# EAGLE design RTC (EAGLE 7.2.0)
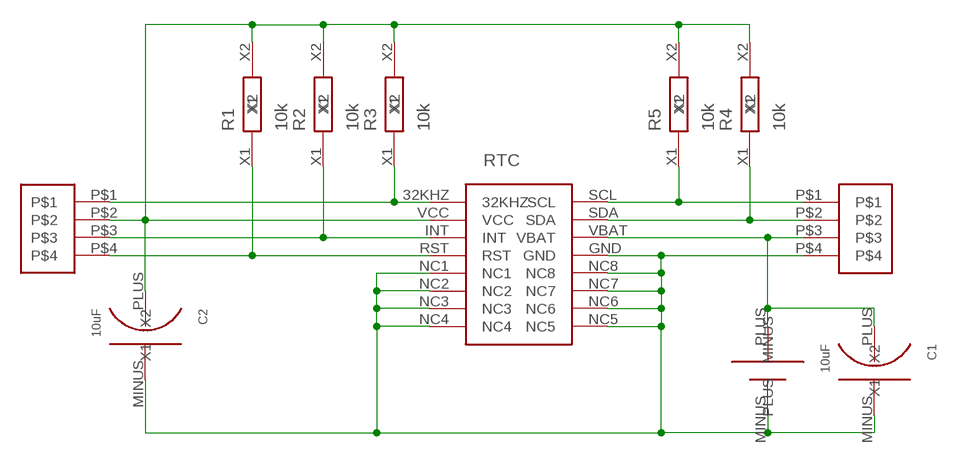
[diagram p0: schematic, sheet 1]

## Parts
C1  10uF  C_SMD_TA_A  [C_SMD_TA_A]
C2  10uF  C_SMD_TA_A  [C_SMD_TA_A]
R1  10k  R_SMD_2.1X1.25  [SMD_2.1X1.25]
R2  10k  R_SMD_2.1X1.25  [SMD_2.1X1.25]
R3  10k  R_SMD_2.1X1.25  [SMD_2.1X1.25]
R4  10k  R_SMD_2.1X1.25  [SMD_2.1X1.25]
R5  10k  R_SMD_2.1X1.25  [SMD_2.1X1.25]
RTC  RTC_DS3231  [RTC_DS3231]
U$2  VBAT  [VBAT]
U$3  4-PIN-NONAME  [4-PIN-NONAME]
U$4  4-PIN-NONAME  [4-PIN-NONAME]

## Nets
N$1: R3.X1 RTC.32KHZ U$4.P$1
N$2: C2.PLUS(X1) R1.X2 R2.X2 R3.X2 R4.X2 R5.X2 RTC.VCC U$4.P$2
N$3: R2.X1 RTC.INT U$4.P$3
N$4: R1.X1 RTC.RST U$4.P$4
N$5: R5.X1 RTC.SCL U$3.P$1
N$6: R4.X1 RTC.SDA U$3.P$2
N$7: C1.PLUS(X1) RTC.VBAT U$2.PLUS U$3.P$3
N$12: C1.MINUS(X2) C2.MINUS(X2) RTC.GND RTC.NC1 RTC.NC2 RTC.NC3 RTC.NC4 RTC.NC5 RTC.NC6 RTC.NC7 RTC.NC8 U$2.MINUS U$3.P$4

## Library data of the parts
C1 C2 = MyAmSys:C_SMD_TA_A
R1-R5 = MyPowerComponents:R_SMD_2.1X1.25
RTC = My_STM32:RTC_DS3231
U$2 = My_STM32:VBAT
U$3 U$4 = MyAmSys:4-PIN-NONAME

## Board
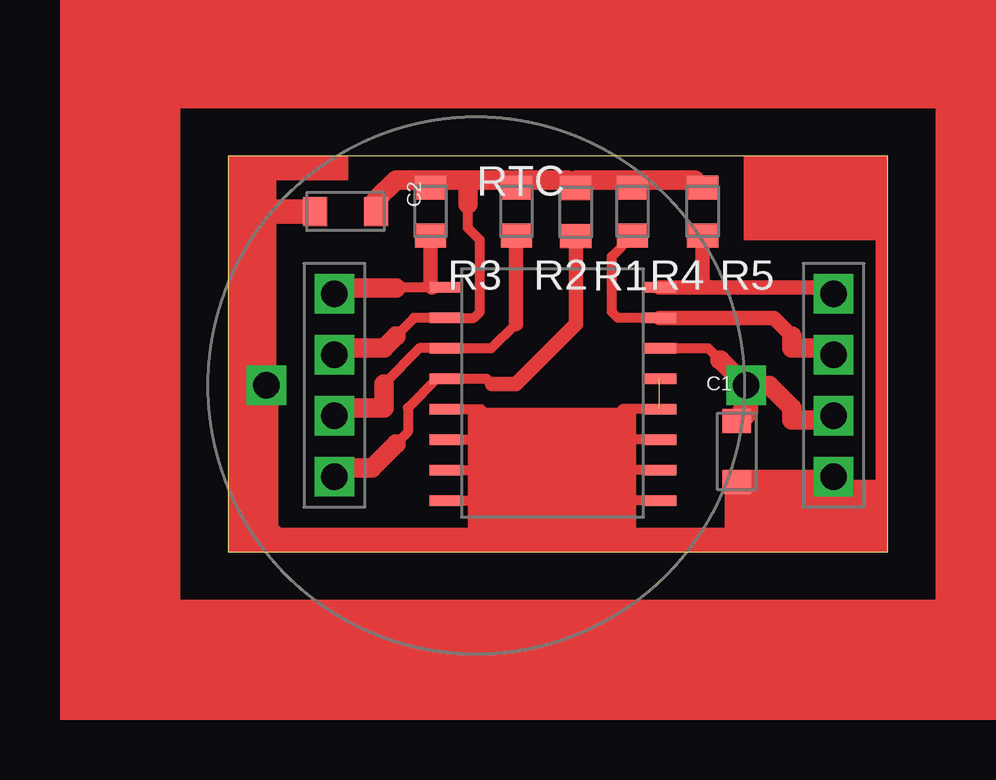
[diagram p1: board, top side]

Size 27.5 x 16.5 mm. Coordinates in mm from the lower left corner, seen from the top.
Outline: 0,0 27.5,0 27.5,16.5 0,16.5 0,0
Copper layers (1*16): Top 0.035mm / dielectric 1.5mm / Bottom 0.035mm
Design rules "default": minimum track width 10mil, minimum drill 24mil, track to track 8mil, track to pad 8mil, pad to pad 8mil, via to via 8mil, smd to smd 8mil, copper to edge 40mil, drill to drill 8mil, minimum pad ring 10mil, minimum via ring 8mil, stop-mask expansion 4mil, vias tented up to drill 0mil, thermal gap 10mil

### Footprints (pad centres in the part's own frame; a part is rotated, then mirrored left to right if it is on the bottom)
C_SMD_TA_A = smd 1.2 x 1: MINUS 0,-1.27; PLUS 0,1.27
SMD_2.1X1.25 = smd 1.3 x 1: X1 0,1; X2 0,-1
RTC_DS3231 = smd 1.4 x 0.44: 32KHZ -5.08,5.08; GND 3.81,1.27; INT -5.08,2.54; NC1 -5.08,0; NC2 -5.08,-1.27; NC3 -5.08,-2.54; NC4 -5.08,-3.81; NC5 3.81,-3.81; NC6 3.81,-2.54; NC7 3.81,-1.27; NC8 3.81,0; RST -5.08,1.27; SCL 3.81,5.08; SDA 3.81,3.81; VBAT 3.81,2.54; VCC -5.08,3.81
VBAT = drill 1.1 square: MINUS 10,0; PLUS -10,0
4-PIN-NONAME = drill 1.1 square: P$1 0,2.54; P$2 0,0; P$3 0,-2.54; P$4 0,-5.08

### Placement (x,y rotation side)
C1  21.21,4.18 0 top
C2  4.9,14.18 270 top
R1  14.5,14.15 180 top
R2  12.03,14.18 180 top
R3  8.45,14.18 180 top
R4  16.87,14.18 180 top
R5  19.79,14.18 180 top
RTC  14.18,5.94 0 top
U$2  11.6,6.93 180 top
U$3  25.25,8.21 0 top
U$4  4.44,8.21 0 top

### Tracks (layer width: path | path; a pad name or v marks a point on that pad's centre or on a via)
N$1
  Top 0.406: RTC.32KHZ 8.5,11.02 7.02,11.02 7,11
  Top 0.61: R3.X1 8.45,11.07 8.5,11.02
  Top 0.813: 7,11 4.69,11 U$4.P$1
N$2
  Top 0.406: 7,9 7.75,9.75 RTC.VCC 10.25,9.75 10.5,10 10.5,13 10,13.5 10,14.5
  Top 0.813: 7,9 6.5,8.5 4.73,8.5 U$4.P$2 | 10,14.5 10,15.5 | 10,15.5 9,15.5 8.77,15.5 | 8.77,15.5 R3.X2 | 10,15.5 11.71,15.5 R2.X2 12.03,15.47 12,15.5 14.15,15.5 R1.X2 14.5,15.5 16.5,15.5 | 16.5,15.5 16.55,15.5 | 16.55,15.5 R4.X2 16.82,15.18 16.5,15.5 | 16.55,15.5 19.47,15.5 R5.X2 | C2.PLUS 6.17,14.67 7,15.5 8.77,15.5
N$3
  Top 0.406: 6.5,7 7.98,8.48 RTC.INT 10.98,8.48 12,9.5
  Top 0.61: 12,9.5 12,13.15 R2.X1
  Top 0.813: 6.5,7 6.5,6 4.77,6 U$4.P$3
N$4
  Top 0.406: 7,4.5 7.5,5 7.5,6 8.71,7.21 RTC.RST 10.79,7.21 11,7
  Top 0.61: R1.X1 14.5,9.5 12,7 11,7
  Top 0.813: 7,4.5 6,3.5 4.81,3.5 U$4.P$4
N$5
  Top 0.61: RTC.SCL 20,11.02 | 20,11.02 24.98,11.02 U$3.P$1 | R5.X1 19.79,11.23 20,11.02
N$6
  Top 0.406: RTC.SDA 16.25,9.75 16,10 16,12.31 R4.X1
  Top 0.61: RTC.SDA 22.75,9.75 23.5,9
  Top 0.813: 23.5,9 23.5,8.5 24.96,8.5 U$3.P$2
N$7
  Top 0.406: RTC.VBAT 20.02,8.48 20.5,8
  Top 0.813: 20.5,8 20.53,8 U$2.PLUS 22.57,6.93 23.5,6 23.5,5.5 25.08,5.5 U$3.P$3
  Top 1.016: U$2.PLUS 21.6,5.84 C1.PLUS
N$12  (1 unrouted)
  Top 0.406: RTC.NC1 10.56,5.94 11.5,5 11.5,4.5 | RTC.NC4 10.63,2.13 11.5,3 11.5,3.5 | 11.5,3.5 11.5,4 11.5,4.5 | RTC.NC8 16.44,5.94 15.5,5 15.5,4.5 | RTC.NC5 16.37,2.13 15.5,3 15.5,3.5 | 15.5,3.5 15.5,4 15.5,4.5 | RTC.NC7 15.67,4.67 15.5,4.5 | RTC.NC6 15.6,3.4 15.5,3.5 | RTC.NC2 11.33,4.67 11.5,4.5 | RTC.NC3 11.4,3.4 11.5,3.5
  Top 1.016: C2.MINUS 1.68,14.18 1.5,14 1.5,7.03 U$2.MINUS 1.6,0.9 2,0.5 13.5,0.5 | 11.5,4 13.5,4 | 13.5,4 15.5,4 | 13.5,0.5 13.5,4 | U$3.P$4 25.03,2.91 C1.MINUS 21.21,0.71 21,0.5 13.5,0.5
(copper drawn outside any net)
  shapes: Top area x15